# Altium project PCB_Project.PrjPcb
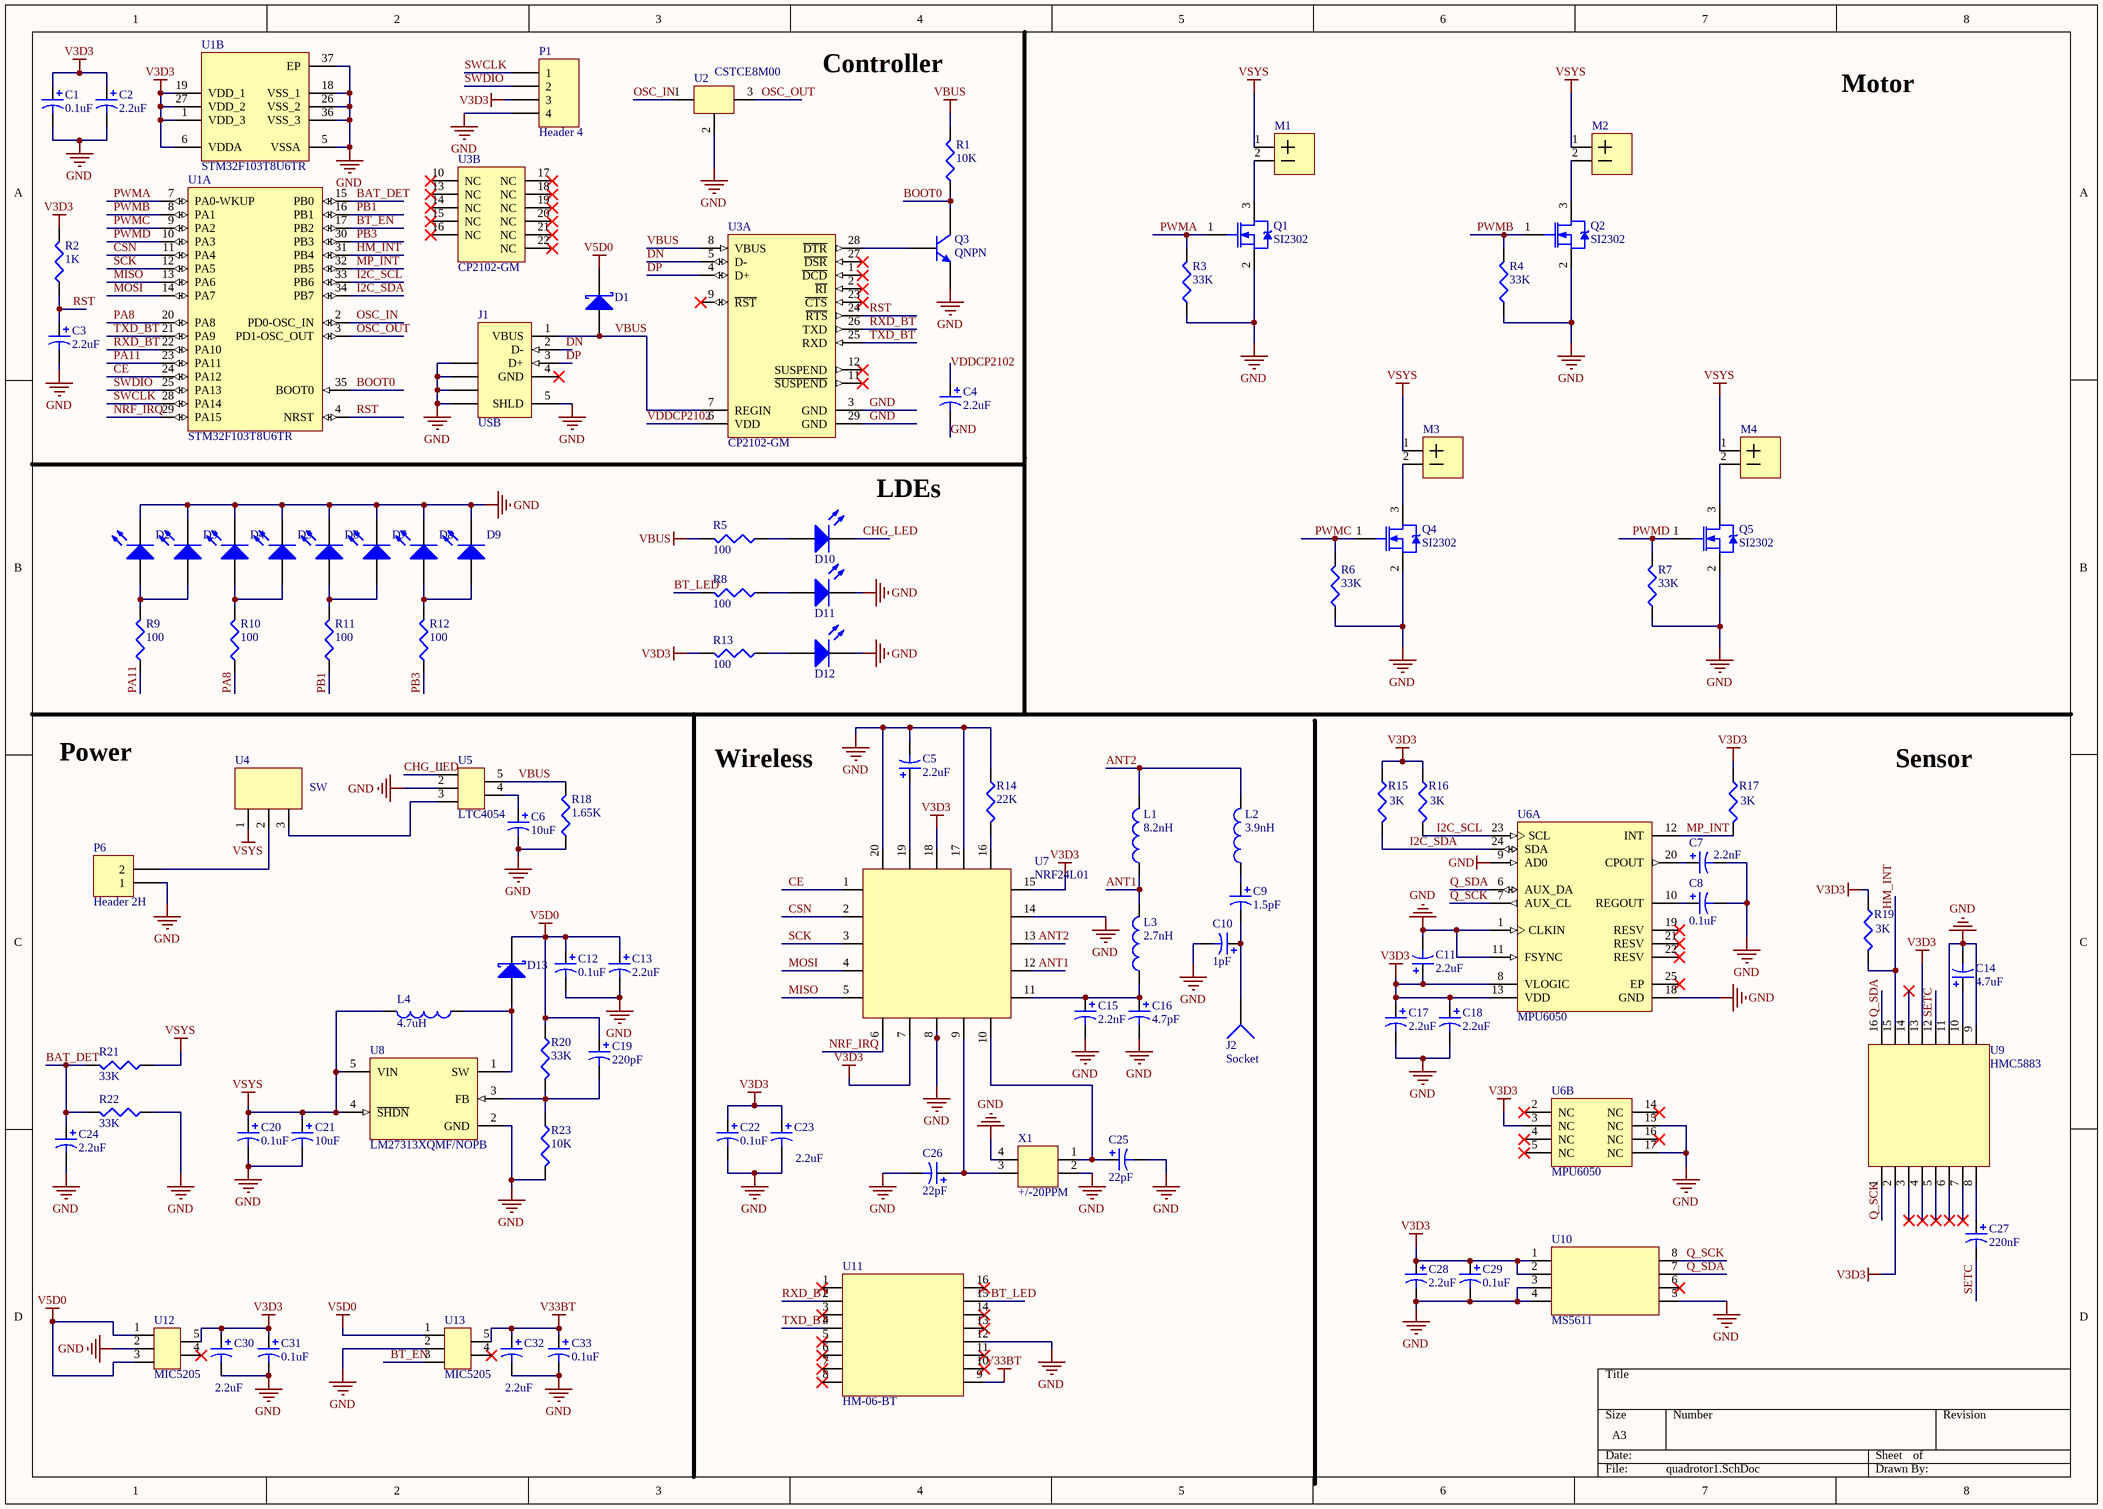
[diagram p0: quadrotor1.SchDoc]
1 sheet, 101 parts. Net scope: global (net labels, ports and power ports of the same name join across sheets).

## Sheet quadrotor1.SchDoc
size A3

### Parts
(Parts that share a designator on the sheet are numbered #1, #2 ... from top to bottom, then left to right.)
C1  value 0.1uF  [0603]  (hidden comment: CAP)
C2  value 2.2uF  [0603]  (hidden comment: CAP)
C3  value 2.2uF  [0603]  (hidden comment: CAP)
C4  value 2.2uF  [0603]  (hidden comment: CAP)
C5  value 2.2uF  [0603]  (hidden comment: CAP)
C6  value 10uF  [0603]  (hidden comment: CAP)
C7  value 2.2nF  [0603]  (hidden comment: CAP)
C8  value 0.1uF  [0603]  (hidden comment: CAP)
C9  value 1.5pF  [0603]  (hidden comment: CAP)
C10  value 1pF  [0603]  (hidden comment: CAP)
C11  value 2.2uF  [0603]  (hidden comment: CAP)
C12  value 0.1uF  [0603]  (hidden comment: CAP)
C13  value 2.2uF  [0603]  (hidden comment: CAP)
C14  value 4.7uF  [0603]  (hidden comment: CAP)
C15  value 2.2nF  [0603]  (hidden comment: CAP)
C16  value 4.7pF  [0603]  (hidden comment: CAP)
C17  value 2.2uF  [0603]  (hidden comment: CAP)
C18  value 2.2uF  [0603]  (hidden comment: CAP)
C19  value 220pF  [0603]  (hidden comment: CAP)
C20  value 0.1uF  [0603]  (hidden comment: CAP)
C21  value 10uF  [0603]  (hidden comment: CAP)
C22  value 0.1uF  [0603]  (hidden comment: CAP)
C23  value 2.2uF  [0603]  (hidden comment: CAP)
C24  value 2.2uF  [0603]  (hidden comment: CAP)
C25  value 22pF  [0603]  (hidden comment: CAP)
C26  value 22pF  [0603]  (hidden comment: CAP)
C27  value 220nF  [0603]  (hidden comment: CAP)
C28  value 2.2uF  [0603]  (hidden comment: CAP)
C29  value 0.1uF  [0603]  (hidden comment: CAP)
C30  value 2.2uF  [0603]  (hidden comment: CAP)
C31  value 0.1uF  [0603]  (hidden comment: CAP)
C32  value 2.2uF  [0603]  (hidden comment: CAP)
C33  value 0.1uF  [0603]  (hidden comment: CAP)
D1  DIODE  [Diode]  (value not drawn)
D2  LED  [DIODE0603]  (value not drawn)
D3  LED  [DIODE0603]  (value not drawn)
D4  LED  [DIODE0603]  (value not drawn)
D5  LED  [DIODE0603]  (value not drawn)
D6  LED  [DIODE0603]  (value not drawn)
D7  LED  [DIODE0603]  (value not drawn)
D8  LED  [DIODE0603]  (value not drawn)
D9  LED  [DIODE0603]  (value not drawn)
D10  LED  [DIODE0603]  (value not drawn)
D11  LED  [DIODE0603]  (value not drawn)
D12  LED  [DIODE0603]  (value not drawn)
D13  DIODE  [Diode]  (value not drawn)
J1  USB  [USB]
J2  Socket  [PIN1]
L1  value 8.2nH  [0603]  (hidden comment: INDUCTOR)
L2  value 3.9nH  [0603]  (hidden comment: INDUCTOR)
L3  value 2.7nH  [0603]  (hidden comment: INDUCTOR)
L4  value 4.7uH  [0603]  (hidden comment: INDUCTOR)
M1  MOTOR  [MOTOR]  (value not drawn)
M2  MOTOR  [MOTOR]  (value not drawn)
M3  MOTOR  [MOTOR]  (value not drawn)
M4  MOTOR  [MOTOR]  (value not drawn)
P1  Header 4  [HDR1X4]
P6  Header 2H  [HDR1X2H]
Q1  SI2302  [SI2303]
Q2  SI2302  [SI2303]
Q3  QNPN  [SOT-23B]
Q4  SI2302  [SI2303]
Q5  SI2302  [SI2303]
R1  value 10K  [0603]  (hidden comment: RES)
R2  value 1K  [0603]  (hidden comment: RES)
R3  value 33K  [0603]  (hidden comment: RES)
R4  value 33K  [0603]  (hidden comment: RES)
R5  value 100  [0603]  (hidden comment: RES)
R6  value 33K  [0603]  (hidden comment: RES)
R7  value 33K  [0603]  (hidden comment: RES)
R8  value 100  [0603]  (hidden comment: RES)
R9  value 100  [0603]  (hidden comment: RES)
R10  value 100  [0603]  (hidden comment: RES)
R11  value 100  [0603]  (hidden comment: RES)
R12  value 100  [0603]  (hidden comment: RES)
R13  value 100  [0603]  (hidden comment: RES)
R14  value 22K  [0603]  (hidden comment: RES)
R15  value 3K  [0603]  (hidden comment: RES)
R16  value 3K  [0603]  (hidden comment: RES)
R17  value 3K  [0603]  (hidden comment: RES)
R18  value 1.65K  [0603]  (hidden comment: RES)
R19  value 3K  [0603]  (hidden comment: RES)
R20  value 33K  [0603]  (hidden comment: RES)
R21  value 33K  [0603]  (hidden comment: RES)
R22  value 33K  [0603]  (hidden comment: RES)
R23  value 10K  [0603]  (hidden comment: RES)
U1  STM32F103T8U6TR  [STM-VFQFPN36_M]  (parts A,B of 2)
U2  CSTCE8M00  [CSTCE8M00]
U3#1  CP2102-GM  [SLAB-QFN-28-3125x3125TP_N]  (part B of 2)
U3#2  CP2102-GM  [SLAB-QFN-28-3125x3125TP_M]  (part A of 2)
U4  SW  [SW]
U5  LTC4054  [LTC4054]
U6  MPU6050  [INSE-QFN-24_V]  (parts A,B of 2)
U7  NRF24L01  [NRF24L01]
U8  LM27313XQMF/NOPB  [DBV0005A_N]
U9  HMC5883  [HMC5883]
U10  MS5611  [MS5611]
U11  HM-06-BT  [HM-06]
U12  MIC5205  [MIC5205]
U13  MIC5205  [MIC5205]
X1  +/-20PPM  [CST20PPM]

### Nets
GND: C1.2 C2.2 C3.2 C4.2 C5.2 C6.2 C7.2 C8.2 C10.2 C11.2 C12.2 C13.2 C14.2 C15.2 C16.2 C17.2 C18.2 C20.2 C21.2 C22.2 C23.2 C24.2 C25.2 C26.2 C28.2 C29.2 C30.2 C31.2 C32.2 C33.2 D2.2(K) D3.2(K) D4.2(K) D5.2(K) D6.2(K) D7.2(K) D8.2(K) D9.2(K) D11.2(K) D12.2(K) J1.5(SHLD) J1.6(SHLD) J1.7(SHLD) J1.8(SHLD) J1.9(SHLD) P1.4 P6.1 Q1.2 Q2.2 Q3.3(E) Q4.2 Q5.2 R3.1 R4.1 R6.1 R7.1 R14.1 R18.1 R22.1 R23.2 U1.5(VSSA) U1.18(VSS_1) U1.26(VSS_2) U1.36(VSS_3) U1.37(EP) U2.2 U3#2.3(GND) U3#2.29(GND) U5.2 U6.1(CLKIN) U6.9(AD0) U6.11(FSYNC) U6.15(NC) U6.17(NC) U6.18(GND) U7.8 U7.14 U7.17 U7.20 U8.2(GND) U9.9 U9.11 U10.3 U10.4 U10.5 U11.12 U12.2 U13.2 X1.2 X1.4
V3D3: C1.1 C2.1 C11.1 C17.1 C18.1 C22.1 C23.1 C28.1 C29.1 C30.1 C31.1 P1.3 R2.2 R13.2 R15.1 R16.1 R17.1 R19.1 U1.1(VDD_3) U1.6(VDDA) U1.19(VDD_1) U1.27(VDD_2) U6.3(NC) U6.8(VLOGIC) U6.13(VDD) U7.7 U7.15 U7.18 U9.2 U9.13 U10.1 U10.2 U12.5
V5D0: C12.1 C13.1 C19.1 D1.K D13.K R20.1 U12.1 U12.3 U13.1
V33BT: C32.1 C33.1 U11.9 U13.5
VBUS: D1.A J1.1(VBUS) R1.2 R5.2 R18.2 U3#2.7(REGIN) U3#2.8(VBUS) U5.5
VSYS: C20.1 C21.1 L4.2 M1.1 M2.1 M3.1 M4.1 R21.1 U4.1 U8.4(~{SHDN}) U8.5(VIN)
ANT1: L1.1 L3.2 U7.12
ANT2: L1.2 L2.2 U7.13
BAT_DET: C24.1 R21.2 R22.2 U1.15(PB0)
BOOT0: Q3.1(C) R1.1 U1.35(BOOT0)
BT_EN: U1.17(PB2) U13.3
BT_LED: R8.2 U11.15
CE: U1.24(PA12) U7.1
CHG_LED: D10.2(K) U5.1
CSN: U1.11(PA4) U7.2
DN: J1.2(D-) U3#2.5(D-)
DP: J1.3(D+) U3#2.4(D+)
HM_INT: R19.2 U1.31(PB4) U9.15
I2C_SCL: R16.2 U1.33(PB6) U6.23(SCL)
I2C_SDA: R15.2 U1.34(PB7) U6.24(SDA)
MISO: U1.13(PA6) U7.5
MOSI: U1.14(PA7) U7.4
MP_INT: R17.2 U1.32(PB5) U6.12(INT)
NRF_IRQ: U1.29(PA15) U7.6
OSC_IN: U1.2(PD0-OSC_IN) U2.1
OSC_OUT: U1.3(PD1-OSC_OUT) U2.3
PA8: R10.1 U1.20(PA8)
PA11: R9.1 U1.23(PA11)
PB1: R11.1 U1.16(PB1)
PB3: R12.1 U1.30(PB3)
PWMA: Q1.1 R3.2 U1.7(PA0-WKUP)
PWMB: Q2.1 R4.2 U1.8(PA1)
PWMC: Q4.1 R6.2 U1.9(PA2)
PWMD: Q5.1 R7.2 U1.10(PA3)
Q_SCK: U6.7(AUX_CL) U9.1 U10.8
Q_SDA: U6.6(AUX_DA) U9.16 U10.7
RST: C3.1 R2.1 U1.4(NRST) U3#2.24(~{RTS})
RXD_BT: U1.22(PA10) U3#2.26(TXD) U11.2
SCK: U1.12(PA5) U7.3
SETC: C27.2 U9.12
SWCLK: P1.1 U1.28(PA14)
SWDIO: P1.2 U1.25(PA13)
TXD_BT: U1.21(PA9) U3#2.25(RXD) U11.4
VDDCP2102: C4.1 U3#2.6(VDD)
NetC5_1: C5.1 U7.19
NetC6_1: C6.1 U5.4
NetC7_1: C7.1 U6.20(CPOUT)
NetC8_1: C8.1 U6.10(REGOUT)
NetC9_1: C9.1 L2.1
NetC9_2: C9.2 C10.1 J2.1
NetC14_1: C14.1 U9.10
NetC15_1: C15.1 C16.1 L3.1 U7.11
NetC19_2: C19.2 R20.2 R23.1 U8.3(FB)
NetC25_1: C25.1 U7.10 X1.1
NetC26_1: C26.1 U7.9 X1.3
NetC27_1: C27.1 U9.8
NetD2_1: D2.1(A) D3.1(A) R9.2
NetD4_1: D4.1(A) D5.1(A) R10.2
NetD6_1: D6.1(A) D7.1(A) R11.2
NetD8_1: D8.1(A) D9.1(A) R12.2
NetD10_1: D10.1(A) R5.1
NetD11_1: D11.1(A) R8.1
NetD12_1: D12.1(A) R13.1
NetD13_A: D13.A L4.1 U8.1(SW)
NetM1_2: M1.2 Q1.3
NetM2_2: M2.2 Q2.3
NetM3_2: M3.2 Q4.3
NetM4_2: M4.2 Q5.3
NetP6_2: P6.2 U4.2
NetQ3_2: Q3.2(B) U3#2.28(~{DTR})
NetR14_2: R14.2 U7.16
NetU4_3: U4.3 U5.3

Not connected (* = marked no-connect by the designer): J1 4(GND)*; U3#1 10(NC)* 13(NC)* 14(NC)* 15(NC)* 16(NC)* 17(NC)* 18(NC)* 19(NC)* 20(NC)* 21(NC)* 22(NC)*; U3#2 1(~{DCD})* 2(~{RI})* 9(~{RST})* 11(~{SUSPEND})* 12(SUSPEND)* 23(~{CTS})* 27(~{DSR})*; U6 2(NC)* 4(NC)* 5(NC)* 14(NC)* 16(NC)* 19(RESV)* 21(RESV)* 22(RESV)* 25(EP)*; U9 3* 4* 5* 6* 7* 14*; U10 6*; U11 1* 3* 5* 6* 7* 8* 10* 11* 13* 14* 16*; U12 4*; U13 4*

### Notes on the sheet
- Controller
- Motor
- LDEs
- Power
- Wireless
- Sensor

### Library data of the parts
P1 = Header 4: Header, 4-Pin; LatestRevisionDate: 17-Jul-2002; LatestRevisionNote: Re-released for DXP Platform.; Publisher: Altium Limited
P6 = Header 2H: Header, 2-Pin, Right Angle; LatestRevisionDate: 17-Jul-2002; LatestRevisionNote: Re-released for DXP Platform.; Publisher: Altium Limited
Q3 = QNPN: NPN Bipolar Transistor; Published: 8-Jun-2000; LatestRevisionDate: 17-Jul-2002; LatestRevisionNote: Re-released for DXP Platform.; PackageReference: SOT-23B; Publisher: Altium Limited; Code_JEDEC: SOT-23
U1 = CMP-0237-00058-3: ARM Cortex-M3 32-bit MCU, 64 KB Flash, 20 KB Internal RAM, 26 I/Os, 36-pin VFQFPN, -40 to 85 degC, Tape and Reel; I/Os (High Current): 26; Supply Voltage(Vcc) min (V): 2; A/D Converter: 2x12-bit (10 Channel); FLASH Size (Prog) (kB): 64; Internal RAM Size (kB): 20; Operating Frequency(F) (Processor speed) (MHz): 72; PartNumber: STM32F103T8U6TR; PackageDescription: 36-Pin Quad Flat No-Lead, 6 x 6 x 1.0 mm Body, 0.5 mm Pitch, Exposed Pad; Packing: Tape and Reel; Mounting Technology: Surface Mount; ComponentLink2URL: http://www.st.com/st-web-ui/static/active/en/resource/technical/document/datasheet/CD00161566.pdf; ComponentLink3URL: http://www.st.com/st-web-ui/static/active/en/resource/technical/document/datasheet/CD00161561.pdf; PackageReference: VFQFPN36; DatasheetVersion: Rev. 16; ComponentLink1URL: http://www.st.com/web/en/home.html; ComponentLink2Description: Datasheet; PackageVersion: Rev. 16, 08/2013; ComponentLink1Description: Manufacturer URL; ComponentLink3Description: Package Specification; Core: ARM Cortex-M3; PartId: 1
U3#1 U3#2 = CMP-0511-00012-1: Single-Chip USB to UART Bridge, 1024 Bytes EEPROM, -40 to 85 degC, 28-pin QFN, Tube; Manufacturer: Silicon Labs; Internal Oscillator: TRUE; Sub-Family: USB Bridges; ComponentLink3Description: Package Specification; PackageDescription: 28-Pin Quad-Flat No-Leads Package, Body 5 x 5 mm, Pitch 0.5 mm; PartNumber: CP2102-GM; EEPROM: 1024 Bytes; Mounting Technology: Surface Mount; ComponentLink2URL: http://www.silabs.com/Support%20Documents/TechnicalDocs/CP2102-9.pdf; DatasheetVersion: Rev. 1.5; ComponentLink1URL: http://www.silabs.com/; ComponentLink2Description: Datasheet; Code_JEDEC: MO-220; PackageReference: QFN-28; Code_IPC: J-STD-020C; ComponentLink3URL: http://www.silabs.com/Support%20Documents/TechnicalDocs/C8051T61x.pdf; ComponentLink1Description: Manufacturer URL
  U3#1: PartId: 2
  U3#2: PartId: 1
U6 = CMP-1753-00002-1: 3-Axis Gyroscope, 3-Axis Accelerometer / , 2.375 to 3.46 V, -40 to 105 degC, 24-Pin QFN, RoHS, Tape and Reel; Resistance: 5.6 kohm; Tolerance: 1%; Voltage Rating: 75 V; Power Rating: 100 mW; ComponentLink1Description: Manufacturer URL; Mount: Surface Mount; Max Operating Temperature: 155degC; Package Quantity: 5000; ComponentLink2Description: Datasheet; Pins: 2; Packaging: Tape and Reel; Case Code (Imperial): 0603; PackageReference: QFN-24; ComponentLink2URL: https://datasheet.ciiva.com/1513/1788002-1513632.pdf; Radiation Hardening: No; ComponentLink1URL: http://www.invensense.com/; PackageDescription: 24-Pin Quad Flat No-lead Package, Body 4 x 4 mm, Pitch 0.5 mm; Height: 0.45 mm; Case/Package: 0603; Case Code (Metric): 1608; REACH SVHC: Yes; Min Operating Temperature: -55degC; DatasheetVersion: Rev. 3.4, 08/2013; Width: 0.8 mm; RoHSCompliant: True; Length: 1.6 mm; PartId: 1
U8 = CMP-0069-02205-2: 1.6 MHz Boost Converter With 30V Internal FET Switch, Automotive Grade 1, 5-pin SOT-23, Pb-Free, 1000 Reel; Manufacturer: Texas Instruments; CompType: Switcher; High-Reliability: Y; PackageTopMarking: SD3B*XTT; PowerWise: N; PartNumber: LM27313XQMF/NOPB; ComponentLink1Description: Datasheet URL; PinCount: 5; PackageReference: DBV0005A; PackageDescription: Molded SOT-23, .115 x .063 x .040 in Body, 5 Lead, .0375 in Pitch; RoHS: Y; ComponentLink1URL: http://www.ti.com/general/docs/lit/getliterature.tsp?genericPartNumber=LM27313-Q1&fileType=pdf
J2 = Socket: LatestRevisionDate: 17-Jul-2002; LatestRevisionNote: Re-released for DXP Platform.; Publisher: Altium Limited